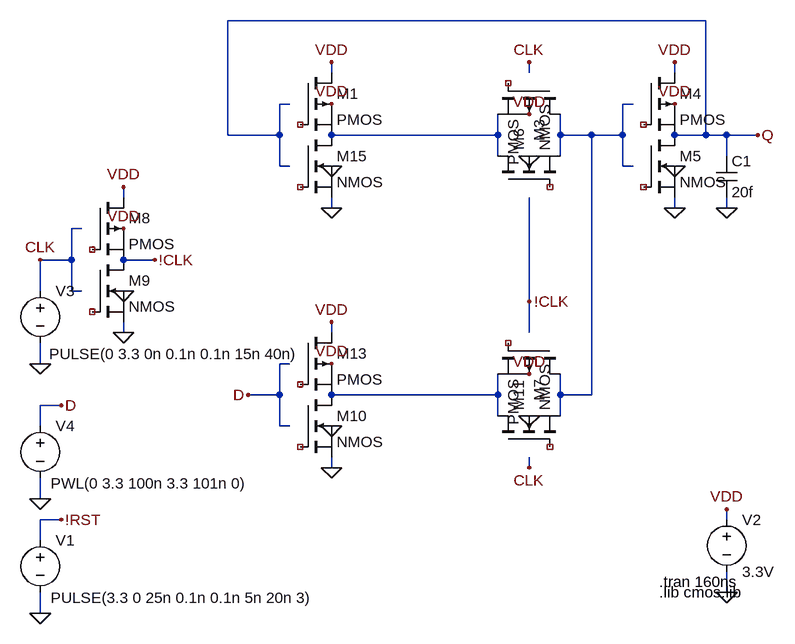
[diagram p0: schematic positive-latch-with-reset-homework.asc]
positive-latch-with-reset-homework.asc, the LTspice schematic file:
Version 4
SHEET 1 1292 680
WIRE -992 -800 -1728 -800
WIRE -1568 -720 -1568 -736
WIRE -1264 -720 -1264 -736
WIRE -1040 -720 -1040 -736
WIRE -1632 -672 -1648 -672
WIRE -1104 -672 -1120 -672
WIRE -1728 -624 -1728 -800
WIRE -1648 -624 -1648 -672
WIRE -1648 -624 -1728 -624
WIRE -1312 -624 -1312 -656
WIRE -1312 -624 -1568 -624
WIRE -1216 -624 -1216 -656
WIRE -1168 -624 -1216 -624
WIRE -1120 -624 -1120 -672
WIRE -1120 -624 -1168 -624
WIRE -992 -624 -992 -800
WIRE -992 -624 -1040 -624
WIRE -960 -624 -992 -624
WIRE -912 -624 -960 -624
WIRE -1312 -592 -1312 -624
WIRE -1216 -592 -1216 -624
WIRE -960 -592 -960 -624
WIRE -1648 -576 -1648 -624
WIRE -1632 -576 -1648 -576
WIRE -1120 -576 -1120 -624
WIRE -1104 -576 -1120 -576
WIRE -1888 -528 -1888 -544
WIRE -1568 -512 -1568 -528
WIRE -1040 -512 -1040 -528
WIRE -960 -512 -960 -528
WIRE -1952 -480 -1968 -480
WIRE -1968 -432 -1968 -480
WIRE -1968 -432 -2016 -432
WIRE -1840 -432 -1888 -432
WIRE -2016 -384 -2016 -432
WIRE -1968 -384 -1968 -432
WIRE -1952 -384 -1968 -384
WIRE -1264 -368 -1264 -528
WIRE -1888 -320 -1888 -336
WIRE -1568 -320 -1568 -336
WIRE -1264 -320 -1264 -368
WIRE -2016 -272 -2016 -304
WIRE -1632 -272 -1648 -272
WIRE -1648 -224 -1648 -272
WIRE -1648 -224 -1696 -224
WIRE -1312 -224 -1312 -256
WIRE -1312 -224 -1568 -224
WIRE -1216 -224 -1216 -256
WIRE -1168 -224 -1168 -624
WIRE -1168 -224 -1216 -224
WIRE -1984 -208 -2016 -208
WIRE -1312 -192 -1312 -224
WIRE -1216 -192 -1216 -224
WIRE -2016 -176 -2016 -208
WIRE -1648 -176 -1648 -224
WIRE -1632 -176 -1648 -176
WIRE -1568 -112 -1568 -128
WIRE -1264 -112 -1264 -128
WIRE -2016 -64 -2016 -96
WIRE -1984 -32 -2016 -32
WIRE -960 -32 -960 -48
WIRE -2016 0 -2016 -32
WIRE -960 80 -960 48
WIRE -2016 112 -2016 80
FLAG -960 80 0
FLAG -960 -48 VDD
FLAG -912 -624 Q
FLAG -2016 -272 0
FLAG -2016 -432 CLK
FLAG -2016 -64 0
FLAG -1984 -208 D
FLAG -960 -512 0
FLAG -1040 -576 0
FLAG -1040 -672 VDD
FLAG -1040 -736 VDD
FLAG -1040 -512 0
FLAG -1888 -384 0
FLAG -1888 -480 VDD
FLAG -1888 -544 VDD
FLAG -1888 -320 0
FLAG -1840 -432 !CLK
FLAG -1264 -592 0
FLAG -1264 -656 VDD
FLAG -1264 -192 0
FLAG -1264 -256 VDD
FLAG -1568 -272 VDD
FLAG -1568 -112 0
FLAG -1696 -224 D
FLAG -1264 -112 CLK
FLAG -1264 -736 CLK
FLAG -1264 -368 !CLK
FLAG -1568 -176 0
FLAG -2016 112 0
FLAG -1984 -32 !RST
FLAG -1568 -336 VDD
FLAG -1568 -672 VDD
FLAG -1568 -512 0
FLAG -1568 -576 0
FLAG -1568 -736 VDD
SYMBOL voltage -960 -48 R0
WINDOW 123 0 0 Left 2
WINDOW 39 0 0 Left 2
SYMATTR InstName V2
SYMATTR Value 3.3V
SYMBOL voltage -2016 -400 R0
WINDOW 123 0 0 Left 2
WINDOW 39 0 0 Left 2
WINDOW 3 14 113 Left 2
SYMATTR Value PULSE(0 3.3 0n 0.1n 0.1n 15n 40n)
SYMATTR InstName V3
SYMBOL voltage -2016 -192 R0
WINDOW 123 0 0 Left 2
WINDOW 39 0 0 Left 2
WINDOW 3 16 104 Left 2
SYMATTR Value PWL(0 3.3 100n 3.3 101n 0)
SYMATTR InstName V4
SYMBOL cap -976 -592 R0
SYMATTR InstName C1
SYMATTR Value 20f
SYMBOL pmos -1088 -720 R0
SYMATTR InstName M4
SYMATTR Value2 l=0.6u w=1.8u
SYMATTR SpiceModel ""
SYMATTR Value PMOS
SYMBOL nmos -1088 -624 R0
SYMATTR InstName M5
SYMATTR SpiceModel ""
SYMATTR Value NMOS
SYMATTR Value2 l=0.6u w=0.9u
SYMBOL pmos -1936 -528 R0
SYMATTR InstName M8
SYMATTR Value2 l=0.6u w=6u
SYMATTR SpiceModel ""
SYMATTR Value PMOS
SYMBOL nmos -1936 -432 R0
SYMATTR InstName M9
SYMATTR SpiceModel ""
SYMATTR Value NMOS
SYMATTR Value2 l=0.6u w=3u
SYMBOL pmos -1216 -704 R90
SYMATTR InstName M3
SYMATTR Value2 l=0.6u w=1.8u
SYMATTR SpiceModel ""
SYMATTR Value PMOS
SYMBOL nmos -1312 -544 R270
SYMATTR InstName M6
SYMATTR SpiceModel ""
SYMATTR Value NMOS
SYMATTR Value2 l=0.6u w=0.9u
SYMBOL pmos -1216 -304 R90
SYMATTR InstName M7
SYMATTR Value2 l=0.6u w=1.8u
SYMATTR SpiceModel ""
SYMATTR Value PMOS
SYMBOL nmos -1312 -144 R270
SYMATTR InstName M11
SYMATTR SpiceModel ""
SYMATTR Value NMOS
SYMATTR Value2 l=0.6u w=0.9u
SYMBOL pmos -1616 -320 R0
SYMATTR InstName M13
SYMATTR Value2 l=0.6u w=1.8u
SYMATTR SpiceModel ""
SYMATTR Value PMOS
SYMBOL nmos -1616 -224 R0
SYMATTR InstName M10
SYMATTR SpiceModel ""
SYMATTR Value NMOS
SYMATTR Value2 l=0.6u w=1.8u
SYMBOL voltage -2016 -16 R0
WINDOW 123 0 0 Left 2
WINDOW 39 0 0 Left 2
WINDOW 3 16 104 Left 2
SYMATTR Value PULSE(3.3 0 25n 0.1n 0.1n 5n 20n 3)
SYMATTR InstName V1
SYMBOL pmos -1616 -720 R0
SYMATTR InstName M1
SYMATTR Value2 l=0.6u w=1.8u
SYMATTR SpiceModel ""
SYMATTR Value PMOS
SYMBOL nmos -1616 -624 R0
SYMATTR InstName M15
SYMATTR SpiceModel ""
SYMATTR Value NMOS
SYMATTR Value2 l=0.6u w=1.8u
TEXT -1064 80 Left 2 !.lib cmos.lib
TEXT -1064 64 Left 2 !.tran 160ns

The netlist it stands for:
* positive-latch-with-reset-homework.asc
V2 VDD 0 3.3V
V3 CLK 0 PULSE(0 3.3 0n 0.1n 0.1n 15n 40n)
V4 D 0 PWL(0 3.3 100n 3.3 101n 0)
C1 Q 0 20f
* M4: PMOS l=0.6u w=1.8u (symbol pmos not certain, pin order unknown); nets seen at it: Q, VDD
* M5: NMOS l=0.6u w=0.9u (symbol nmos not certain, pin order unknown); nets seen at it: 0, Q
* M8: PMOS l=0.6u w=6u (symbol pmos not certain, pin order unknown); nets seen at it: !CLK, VDD
* M9: NMOS l=0.6u w=3u (symbol nmos not certain, pin order unknown); nets seen at it: !CLK, 0
* M3: PMOS l=0.6u w=1.8u (symbol pmos not certain, pin order unknown); nets seen at it: N001, N002
* M6: NMOS l=0.6u w=0.9u (symbol nmos not certain, pin order unknown); nets seen at it: N001, N002
* M7: PMOS l=0.6u w=1.8u (symbol pmos not certain, pin order unknown); nets seen at it: N001, N003
* M11: NMOS l=0.6u w=0.9u (symbol nmos not certain, pin order unknown); nets seen at it: N001, N003
* M13: PMOS l=0.6u w=1.8u (symbol pmos not certain, pin order unknown); nets seen at it: N003, VDD
* M10: NMOS l=0.6u w=1.8u (symbol nmos not certain, pin order unknown); nets seen at it: 0, N003
V1 !RST 0 PULSE(3.3 0 25n 0.1n 0.1n 5n 20n 3)
* M1: PMOS l=0.6u w=1.8u (symbol pmos not certain, pin order unknown); nets seen at it: N002, VDD
* M15: NMOS l=0.6u w=1.8u (symbol nmos not certain, pin order unknown); nets seen at it: 0, N002
.lib cmos.lib
.tran 160ns
.backanno
.end